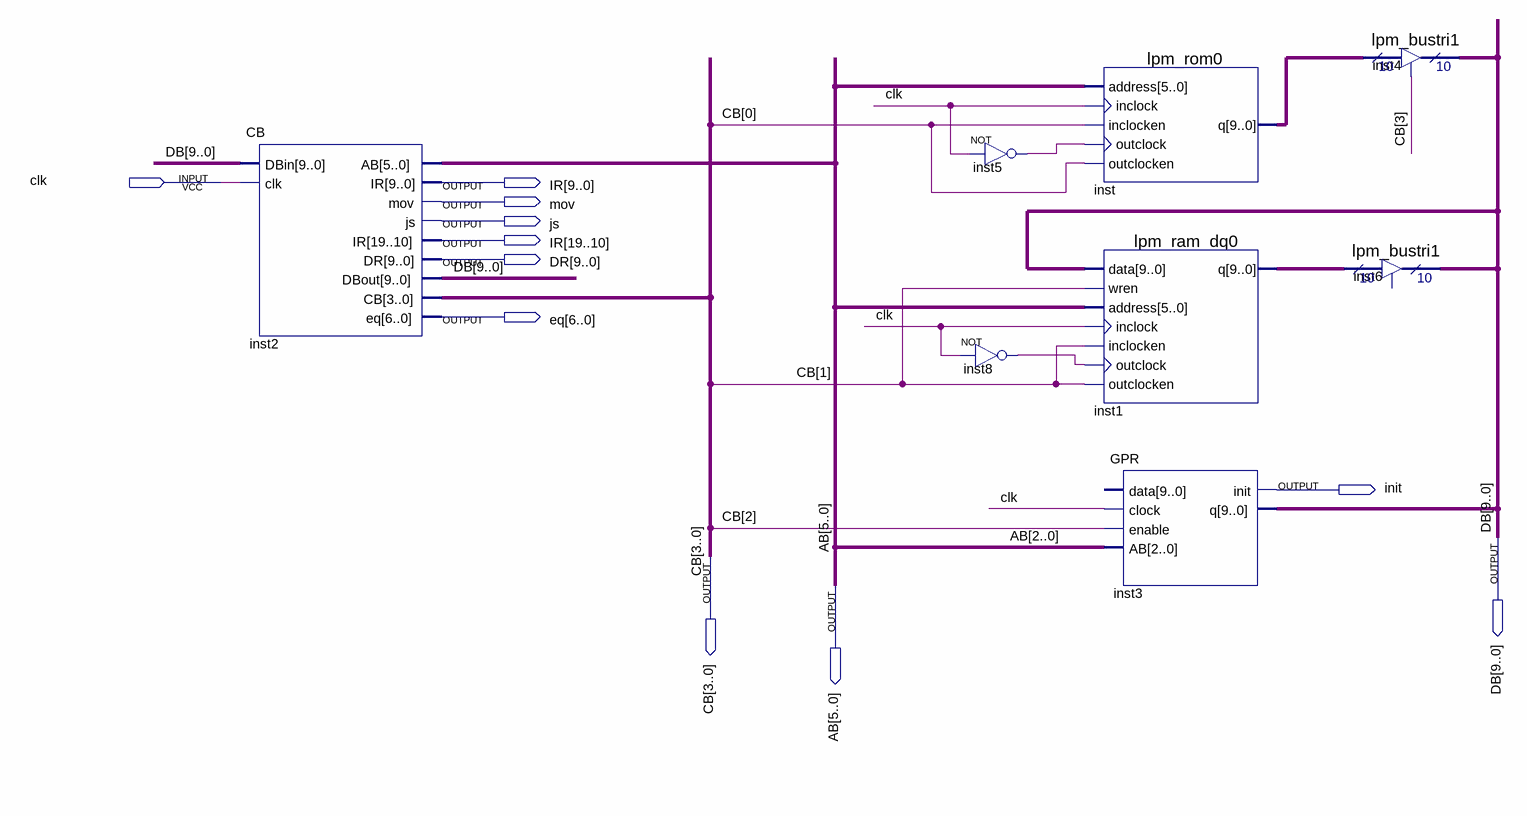
[diagram p0: schematic sheet]
// Quartus schematic Comands.bdf as structural Verilog: 8 symbols, 11 pins
module Comands (
  input  clk,
  output [19:0] IR,
  output mov,
  output js,
  output [9:0] DR,
  output [6:0] eq,
  output init,
  output [9:0] DB,
  output [3:0] CB,
  output [5:0] AB
);

  wire inst5_out, inst8_out;
  wire [9:0] inst1_q, inst_q;

  CB inst2 (.DBin(DB), .clk(clk), .AB(AB), .IR(IR), .mov(mov), .js(js), .DR(DR), .DBout(DB), .CB(CB), .eq(eq));
  not inst5 (inst5_out, clk);
  not inst8 (inst8_out, clk);
  lpm_rom0 inst (.address(AB), .inclock(clk), .inclocken(CB[0]), .outclock(inst5_out), .outclocken(CB[0]), .q(inst_q));
  lpm_ram_dq0 inst1 (
    .data(DB), .wren(CB[1]), .address(AB), .inclock(clk), .inclocken(CB[1]), .outclock(inst8_out),
    .outclocken(CB[1]), .q(inst1_q));
  GPR inst3 (.clock(clk), .enable(CB[2]), .AB(AB[2:0]), .init(init), .q(DB));  // open: data
  lpm_bustri1 inst4 (.enabledt(CB[3]), .data(inst_q), .tridata(DB));
  lpm_bustri1 inst6 (.data(inst1_q), .tridata(DB));  // open: enabledt
endmodule
